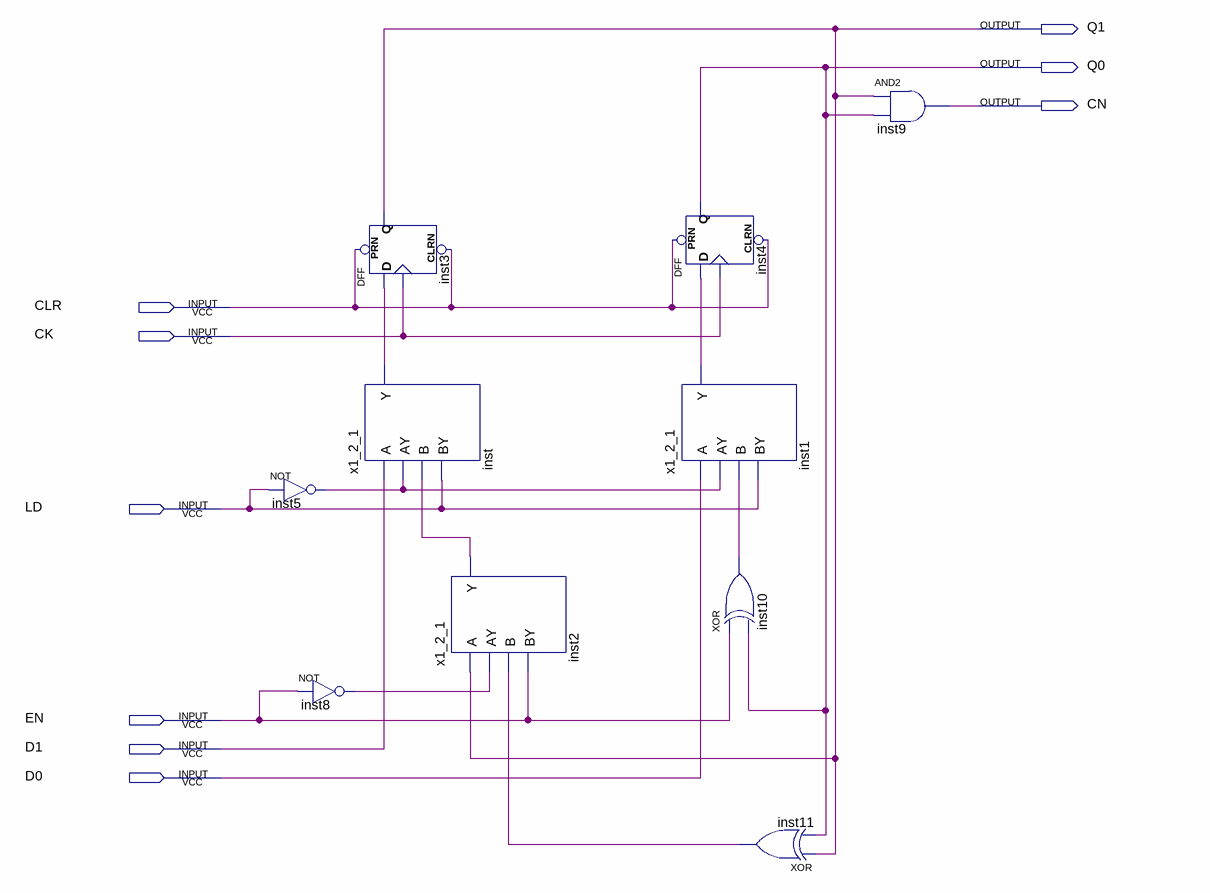
[diagram p0: schematic sheet]
// Quartus schematic count_4.bdf as structural Verilog: 10 symbols, 9 pins
module count_4 (
  input  CLR,
  input  CK,
  input  LD,
  input  EN,
  input  D1,
  input  D0,
  output Q1,
  output Q0,
  output CN
);

  wire inst1_y, inst2_y, inst5_out, inst8_out, inst10_out, inst11_out, inst_y;

  not inst5 (inst5_out, LD);
  not inst8 (inst8_out, EN);
  DFF inst3 (.CLRN(CLR), .CLK(CK), .D(inst_y), .PRN(CLR), .Q(Q1));
  x1_2_1 inst (.A(D1), .AY(inst5_out), .B(inst2_y), .BY(LD), .Y(inst_y));
  x1_2_1 inst2 (.A(Q1), .AY(inst8_out), .B(inst11_out), .BY(EN), .Y(inst2_y));
  DFF inst4 (.CLRN(CLR), .CLK(CK), .D(inst1_y), .PRN(CLR), .Q(Q0));
  x1_2_1 inst1 (.A(D0), .AY(inst5_out), .B(inst10_out), .BY(LD), .Y(inst1_y));
  xor inst10 (inst10_out, EN, Q0);
  xor inst11 (inst11_out, Q1, Q0);
  and inst9 (CN, Q1, Q0);
endmodule
